# EAGLE design 8bit_Wing_Template (EAGLE 5.11)
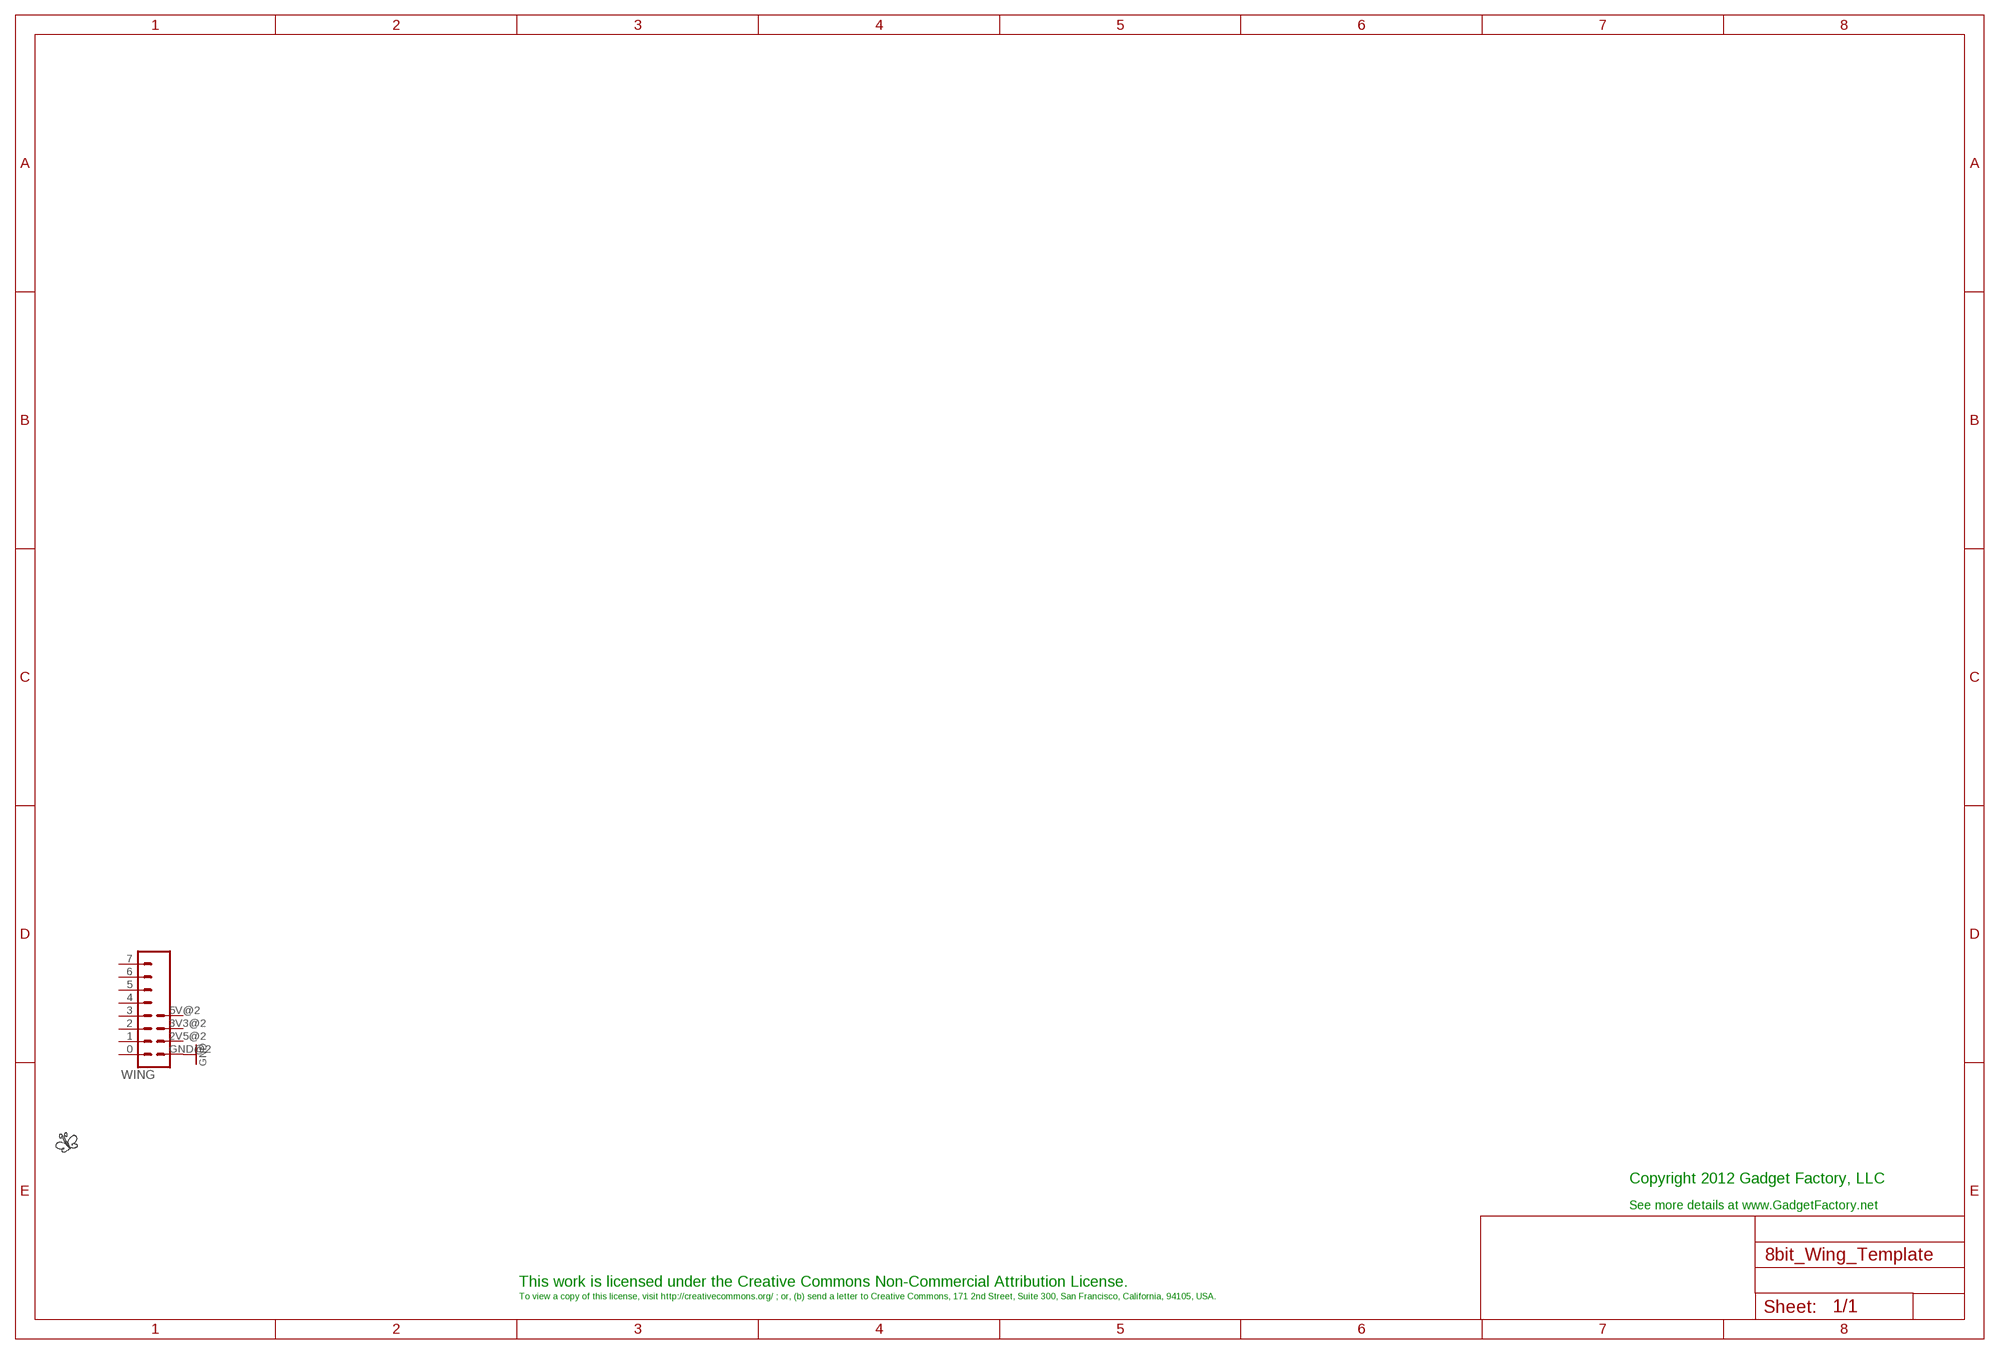
[diagram p0: schematic, sheet 1]

## Parts
LOGO2  BUTTERFLY_LOGO  [BUTTERFLY_LOGO]
WING  WING8  [WINGSIDE_8BIT]

## Nets
GND: WING.GND@2(GND)
Unconnected: WING.0 WING.1 WING.2 WING.2V5@2(2V5) WING.3 WING.3V3@2(3V3) WING.4 WING.5 WING.5V@2(5V) WING.6 WING.7

## Notes on the sheet
- Copyright 2012 Gadget Factory, LLC
- See more details at www.GadgetFactory.net
- This work is licensed under the Creative Commons Non-Commercial Attribution License.
- To view a copy of this license, visit http://creativecommons.org/ ; or, (b) send a letter to Creative Commons, 171 2nd Street, Suite 300, San Francisco, California, 94105, USA.

## Library data of the parts
LOGO2 = GadgetFactory_Pub:BUTTERFLY_LOGO
WING = Papilio:WING8

## Board
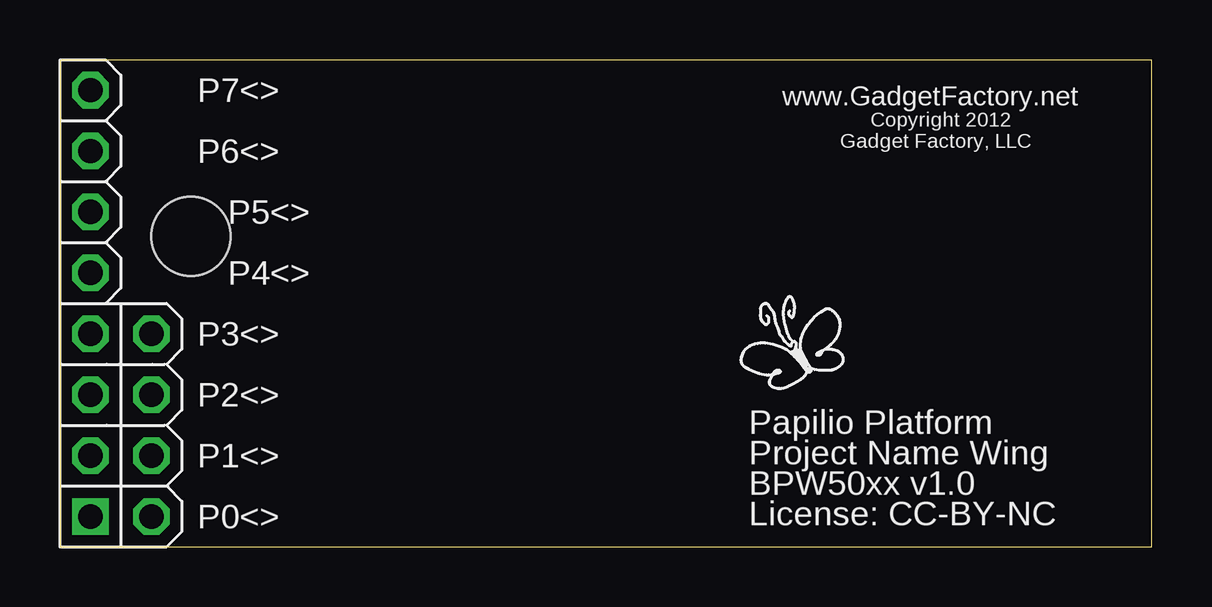
[diagram p1: board, top side]
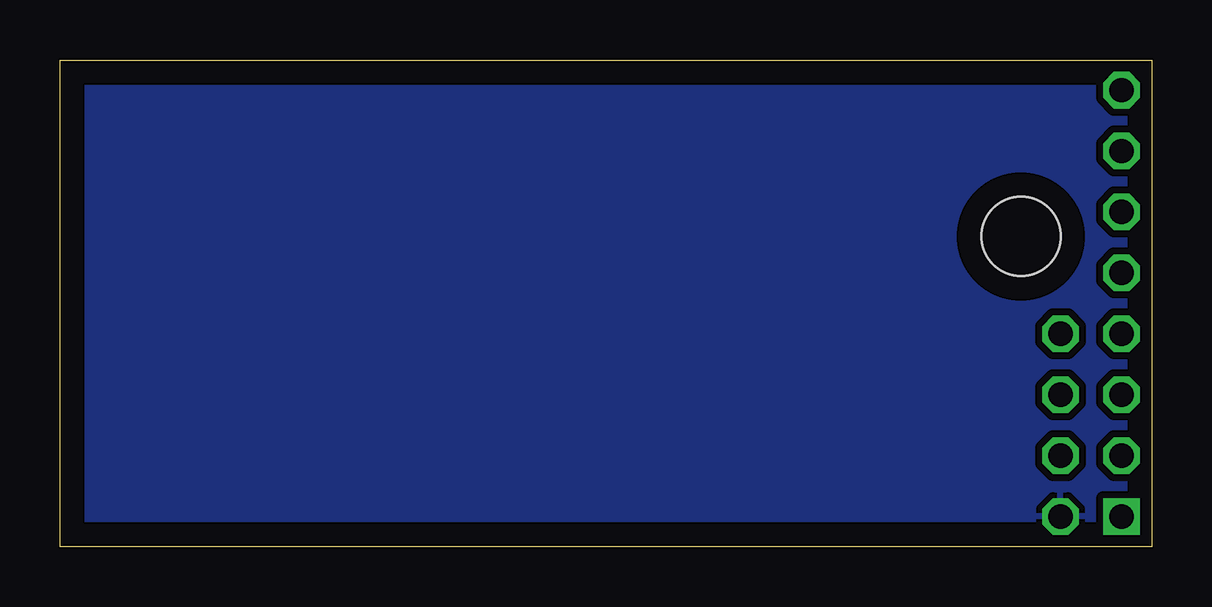
[diagram p2: board, bottom side, seen from below]

Size 45.52 x 20.31 mm. Coordinates in mm from the lower left corner, seen from the top.
Outline: 0,0 45.52,0 45.52,20.31 0,20.31 0,0
Copper layers (1*16): Top 0.035mm / dielectric 1.5mm / Bottom 0.035mm
Design rules "default": minimum track width 10mil, minimum drill 24mil, track to track 8mil, track to pad 8mil, pad to pad 8mil, via to via 8mil, smd to smd 8mil, copper to edge 40mil, drill to drill 8mil, minimum pad ring 10mil, minimum via ring 8mil, stop-mask expansion 4mil, vias tented up to drill 0mil, thermal gap 10mil

### Footprints (pad centres in the part's own frame; a part is rotated, then mirrored left to right if it is on the bottom)
WINGSIDE_8BIT = drill 1.016 square: 0 19.05,1.27 | drill 1.016 octagon: 1 16.51,1.27; 2 13.97,1.27; 2V5@2 16.51,3.81; 3 11.43,1.27; 3V3@2 13.97,3.81; 4 8.89,1.27; 5 6.35,1.27; 5V@2 11.43,3.81; 6 3.81,1.27; 7 1.27,1.27; GND@2 19.05,3.81 | hole 3.302: 7.366,5.461

### Placement (x,y rotation side)
LOGO2  30.61,8 0 top
WING  0,20.32 270 top

### Tracks (layer width: path | path; a pad name or v marks a point on that pad's centre or on a via)
GND
  pour Bottom (isolate 0.305): 0,20.32 45.72,20.32 45.72,0 0,0

### Text on the board
tPlace: P7<> | www.GadgetFactory.net | Copyright 2012 | Gadget Factory, LLC | P6<> | P5<> | P4<> | P3<> | P2<> | Papilio Platform | P1<> | Project Name Wing | BPW50xx v1.0 | P0<> | License: CC-BY-NC